# Altium schematic sheet PFC_15V_PwrSRegulator.SchDoc
size A4; SheetNumber: 4; SheetTotal: 8
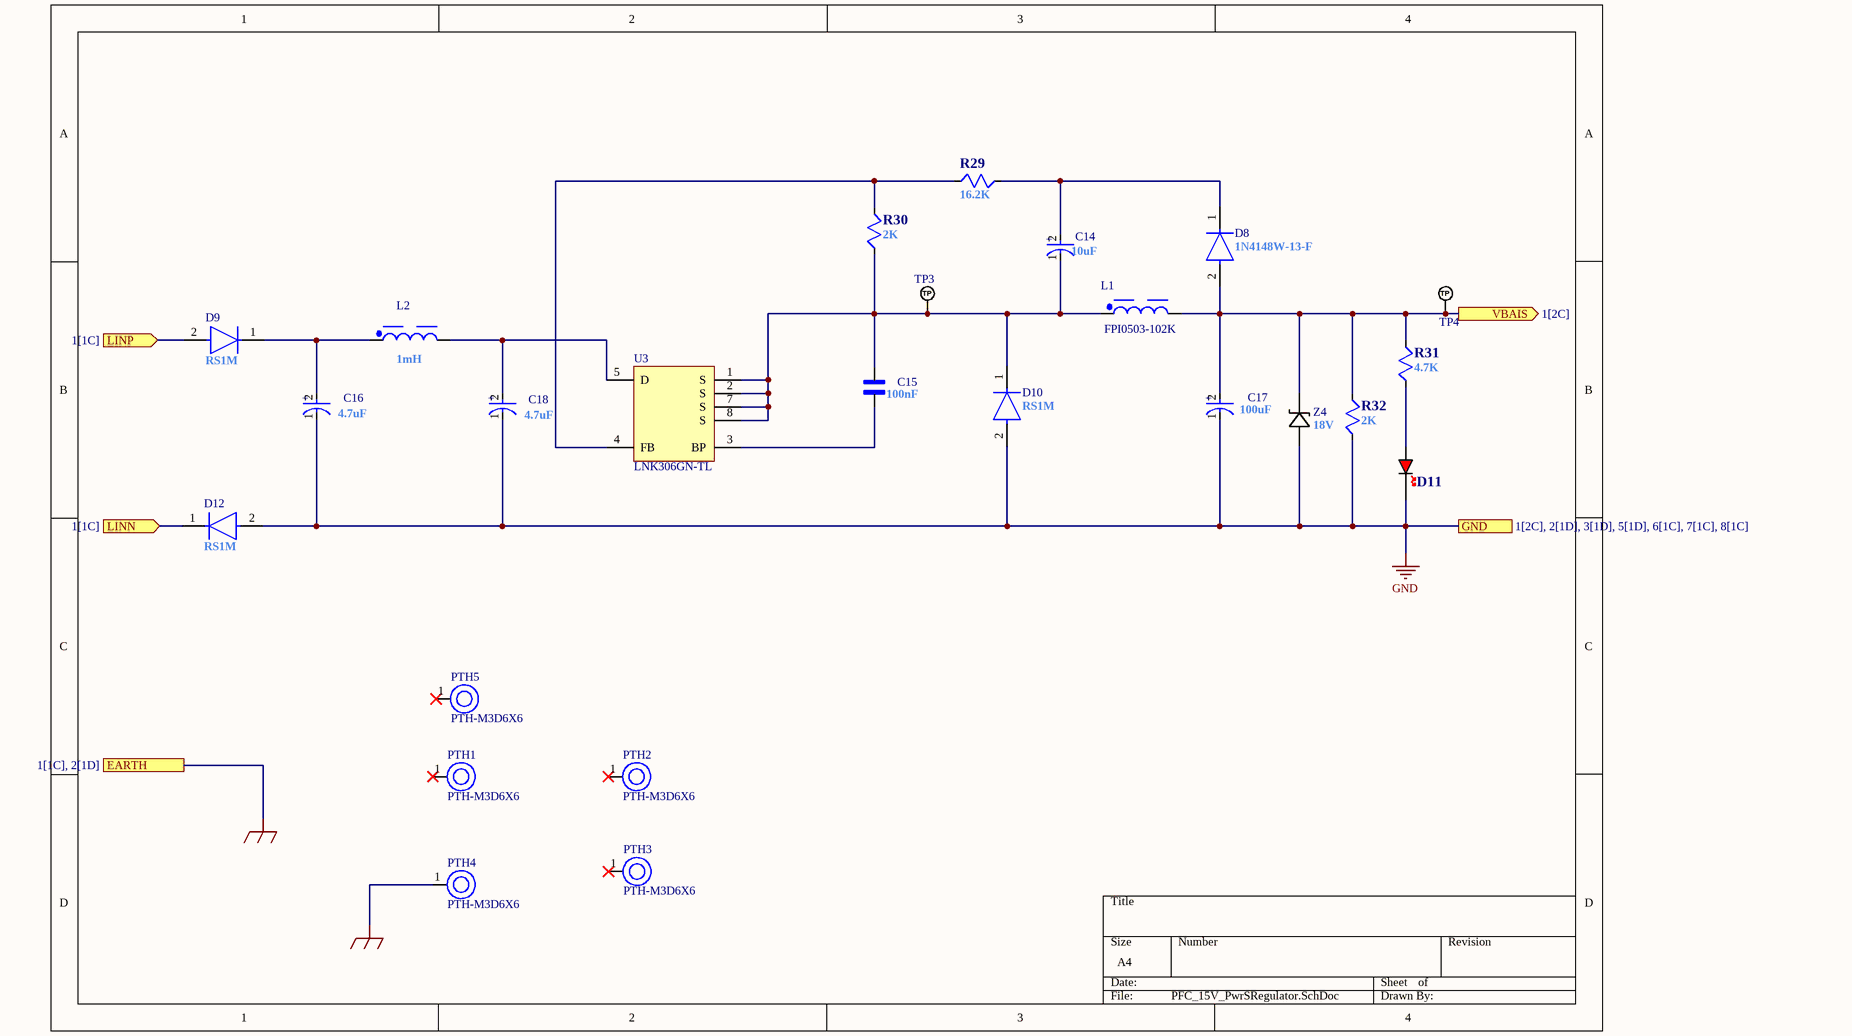
[diagram p0: PFC_15V_PwrSRegulator.SchDoc]

## Parts
C14  Capacitance: 10uF  [FP-FKC-MFG]  (hidden comment: SC1V106M05005VR)
C15  value 100nF  [CAPC3216X140N]  (hidden comment: C1206C104KARECAUTO)
C16  Capacitance: 4.7uF  [FP-RAD-TH-D_10_0_5-L_12_5-MFG]  (hidden comment: PKLH-400V4R7MG125-T/A5.0)
C17  Capacitance: 100uF  [FP-SEV8X10_5-MFG]  (hidden comment: CKL025M101F10PKKKV00A)
C18  Capacitance: 4.7uF  [FP-RAD-TH-D_10_0_5-L_12_5-MFG]  (hidden comment: PKLH-400V4R7MG125-T/A5.0)
D8  1N4148W-13-F  [FP-SOD123-MFG]
D9  RS1M  [FP-403AE-MFG]
D10  RS1M  [FP-403AE-MFG]
D11  19-21/R6C-AP1Q2/4T  [LED_0603_RED]  (value not drawn)
D12  RS1M  [FP-403AE-MFG]
L1  FPI0503-102K  [WE-LQS_6045]
L2  Inductance: 1mH  [WE-PD2_1054]  (hidden comment: FPI0705-102K(W0.15))
PTH1  PTH-M3D6X6  [PH3.2]
PTH2  PTH-M3D6X6  [PH3.2]
PTH3  PTH-M3D6X6  [PH3.2]
PTH4  PTH-M3D6X6  [PH3.2]
PTH5  PTH-M3D6X6  [PH3.2]
R29  value 16.2K  [RESC1608N]  (hidden comment: 0603SAF1622T5E)
R30  value 2K  [RESC1608N]  (hidden comment: HP03W5F2001T5E)
R31  value 4.7K  [RESC1608N]  (hidden comment: 0603SAF4701T5E)
R32  value 2K  [RESC1608N]  (hidden comment: HP03W5F2001T5E)
TP3  TP_NOBOM  [PAD_RND_1MM]  (value not drawn)  (no BOM)
TP4  TP_NOBOM  [PAD_RND_1MM]  (value not drawn)  (no BOM)
U3  LNK306GN-TL  [PI-SMD-8B-7_V]
Z4  Type: 18V  [ZDO_SOD323_DIO-M]  (hidden comment: MMSZ5248BS-7-F)

## Ports
EARTH (see 1[1C], 2[1D]), GND (see 1[2C], 2[1D], 3[1D], 5[1D], 6[1C], 7[1C], 8[1C]), LINN (in, see 1[1C]), LINP (in, see 1[1C]), VBAIS (out, see 1[2C])

## Nets
EARTH: PTH4.1 ; port EARTH
GND: C16.1(C) C17.1(C) C18.1(C) D10.2(A) D11.K D12.2(A) R32.2 Z4.2 ; port GND
LINN: D12.1(C) ; port LINN
LINP: D9.2(A) ; port LINP
VBAIS: C17.2(A) D8.2(A) L1.2 R31.1 R32.1 TP4.1(TP) Z4.1 ; port VBAIS
NetC14_1: C14.1(C) C15.2 D10.1(C) L1.1 R30.2 TP3.1(TP) U3.1(S) U3.2(S) U3.7(S) U3.8(S)
NetC14_2: C14.2(A) D8.1(C) R29.1
NetC15_1: C15.1 U3.3(BP)
NetC16_2: C16.2(A) D9.1(C) L2.1
NetC18_2: C18.2(A) L2.2 U3.5(D)
NetD11_A: D11.A R31.2
NetR29_2: R29.2 R30.1 U3.4(FB)

Not connected (* = marked no-connect by the designer): PTH1 1*; PTH2 1*; PTH3 1*; PTH5 1*

## Notes on the sheet
- (in symbol CMP-05427-000030-1) +
- (in symbol CMP-05427-001671-1) +
- (in symbol CMP-35376-000024-1) +

## Library data of the parts
C14 = CMP-05427-000030-1: CAP.EL.10uF 35V 5x5.3 85C SMD SAMWHA; Impedance: 1.52R; Ripple Current (AC): 32mA; Tolerance: 20%; Ripple Current: 85mA; Life (Hours): 2000Hour; Leakage Current: 3uA; Voltage Rating (DC): 50V; Dielectric Material: Aluminium; Length: 5.8mm; Voltage Rating: 35V; Radiation Hardening: No; Max Operating Temperature: 105°C; REACH SVHC: No SVHC; RoHS Compliant: Yes; Case/Package: Radial; Height: 5.8mm; Voltage: 35V; Diameter: 5mm; Number of Pins: 2; Series: FK; Lead Free: Lead Free; Width: 6.5mm; ESR (Equivalent Series Resistance): 1.52R; Package Quantity: 1000; Construction: Cylindrical; Packaging: Tape and Reel; Height - Seated (Max): 0.228inch; Contact Plating: Tin; Min Operating Temperature: -55°C; Termination: SMD/SMT; Material: Aluminium; Mount: Surface Mount
C15 = C1206C104KARECAUTO: 0.1 ÂµF Â±10% 250V Ceramic Capacitor X7R 1206 (3216 Metric); MF: KEMET; SnapEDA_Link: https://www.snapeda.com/parts/C1206C104KARECAUTO/Kemet/view-part/?ref=snap; Package: 3216 KEMET; MP: C1206C104KARECAUTO; Check_prices: https://www.snapeda.com/parts/C1206C104KARECAUTO/Kemet/view-part/?ref=eda
C16 C18 = CMP-05427-001671-1: CAP.EL.4u7 400V 10X12.5 5MM %20 105C LOW IMP; Dissipation Factor: 0.2%; Tolerance: 20%; Ripple Current (AC): 65mA; Polarity: Polar; Life (Hours): 2000Hour; Lead/Base Style: Straight; Lead Diameter: 0.6mm; Voltage Rating (DC): 350V; Length: 12.5mm; Height - Seated (Max): 0.531inch; Mount: Through Hole; Diameter: 10mm; Case/Package: Radial; Max Operating Temperature: 85°C; Ripple Current: 65mA; Radiation Hardening: No; Lead Pitch: 5mm; Packaging: Bulk; Termination: Radial; Construction: RADIAL; Series: M; REACH SVHC: No SVHC; RoHS Compliant: Yes; Voltage Rating: 350V; Min Operating Temperature: -25°C; Height: 12.5mm; Package Quantity: 200
C17 = CMP-35376-000024-1: CAP.EL.100uF 25V 8x10 105C 5000H AEC-Q200 SMT; Polarity: Polar; Life (Hours): 2000Hour; Tolerance: 20%; Ripple Current: 240mA; Case/Package: Radial; Package Quantity: 1; Voltage Rating: 25V; Min Operating Temperature: -40°C; Lead Pitch: 3.1mm; Height - Seated (Max): 0.413inch; Ratings: AEC-Q200; Lead Free: Lead Free; Construction: Cylindrical; Max Operating Temperature: 85°C; Packaging: Tape and Reel; RoHS Compliant: Yes; Mount: Surface Mount; Radiation Hardening: No; Series: SEV
D8 = CMP-12791-000005-1: DIODE GEN PURP 100V 150MA SOD123; Manufacturer: Diodes Inc.; Capacitance: 2pF; Forward Current: 300mA; Max Junction Temp: +150°C; Value: 2pF; Standoff Height: 0mm; Peak Reverse Current: 1uA; Max Surge Forward Current: 1A; Category: Diode; Height: 1.45mm; ComponentLink2URL: https://upverter.com/datasheet/628e7d6fee5901eee6eef4567d1c3569f2cd3cde.pdf; Lead Free: Yes; ComponentLink2Description: Datasheet; Octopart: https://octopart.com/1n4148w-13-f-diodes+inc.-2359612; Temperature Range High: +150°C; Device Class L2: Diodes; Digikey Description: DIODE GEN PURP 100V 150MA SOD123; Reverse Voltage: 100V; Temperature Range Low: -65°C; Device Class L1: Discrete Semiconductors; Package: SOD123; RoHS: TRUE; Manufacturer Part Number: 1N4148W-13-F; Footprint Url: https://www.diodes.com/assets/Package-Files/SOD123.pdf; Automotive: No; Max Repetitive Reverse Voltage: 100V; Mouser Description: 1N4148W Series 2 A 100 V 400 mW Surface Mount Fast Switching Diode - SOD-123; Temperature: -65°C to +150°C; Device Class L3: Rectifier Diodes
D9 D10 D12 = CMP-07163-000022-1: DIODE GEN PURP 1KV 1A SMA; Manufacturer: ON Semiconductor; Max Surge Forward Current: 30A; Max Repetitive Reverse Voltage: 1000V; Value: 10pF; Max Junction Temp: +150°C; Peak Reverse Current: 5uA; Standoff Height: 0.05mm; ComponentLink2URL: https://www.onsemi.com/pub/Collateral/RS1M-D.PDF; Footprint Url: https://www.onsemi.com/pub/Collateral/403AE.PDF; Mouser Description: On a Reel of 7500, ON Semi 1000V 1A, Diode, 2-Pin DO-214AC RS1M; Package: 403AE; Manufacturer Part Number: RS1M; Temperature Range Low: -55°C; Device Class L1: Discrete Semiconductors; Automotive: No; Height: 2.5mm; Octopart: https://octopart.com/rs1m-on+semiconductor-84331238; Digikey Description: DIODE GEN PURP 1KV 1A SMA; Temperature Range High: +150°C; Capacitance: 10pF; RoHS: TRUE; Device Class L2: Diodes; ComponentLink2Description: Datasheet; Temperature: -55°C to +150°C; Device Class L3: Rectifier Diodes; Forward Current: 1A; Lead Free: Yes; Category: Diode
D11 = LED_0603_RED: LED SMD 0603 RED 28.5-72mcd 100° WATER CLEAR
L1 = CMP-03913-61645236-2: POWER INDUCTOR General Purpose Inductor, 1000uH, 10%, 1 Element, SMD, 2424; Inductance Tolerance: 20%; Test Frequency: 100kHz; Saturation Current: 365mA; Inductance: 1mH; Self Resonant Frequency: 1.86MHz; Current Rating: 300mA; DC Resistance (DCR): 4.783Ω; Shielding: Shielded; Length: 6mm; Min Operating Temperature: -40°C; Height: 4.5mm; Ambient Temperature Range Low: -40°C; Composition: Wirewound; RoHS: Compliant; Ambient Temperature Range High: 85°C; Height - Seated (Max): 4.4958mm; Mount: Surface Mount; Max Operating Temperature: 125°C; Packaging: Tape & Reel (TR); Case/Package: Nonstandard; Tolerance: 20%; Width: 6mm
L2 = CMP-0227-00499-2: INDUCTOR POWER 1mH 7.8X7.0X5.0MM SMD; Test Frequency: 10kHz; DC Resistance (DCR): 3.3 Ohm; RMS Current (Irms): 380mA; Tolerance: 10%; Inductance Tolerance: 20%; Shielding: Unshielded; Core Material: Ferrite; Packaging: Digi-Reel®; Composition: Wirewound; Lead Free: Lead Free; Min Operating Temperature: -40°C; Saturation Current: N/A; RoHS: Compliant; Height - Seated (Max): 5.8928mm; Ambient Temperature Range Low: -40°C; Case/Package: Nonstandard; Termination: SMD/SMT; REACH SVHC: Unknown; Width: 10mm; Ambient Temperature Range High: 85°C; Length: 9mm; Mount: Surface Mount; Height: 5.4mm; Max Operating Temperature: 125°C
PTH1-PTH5 = PTH_S1
R29 = RES: RES.(1608) 0603 16.2K Ohms 1% 1/10W-S 100PPM
R30 R32 = RES: RES.(1608) 0603 2K Ohms 1% 1/5W
R31 = RES: RES.(1608) 0603 4.7K Ohms 1% 1/10W-S 100PPM
TP3 TP4 = TEST_POINT_RND_1MM: Test Point Round 1mm (NO BOM)
U3 = CMP-2000-06569-1: Lowest Component Count, Energy-Efficient Off-Line Switcher IC, 85 to 265 V, 220 uA, -40 to 150 degC, 7-Pin SMD, RoHS, Tube; Manufacturer: Power Integrations; Output type: Adjustable; Function: Regulator; Topology: Flyback; Input voltage: 85...265VAC; Mounting Technology: SurfaceMount; Datasheet Version: Rev. J, 06/2013; Datasheet URL: http://www.mouser.com/ds/2/328/lnk302_304-306-179954.pdf; Package Reference: SMD-8B-7; Manufacturer URL: https://www.power.com/; Package: SMD-8B(7-PIN); Package Description: 7-Pin Surface Mount Device, Body 9.575 x 6.35 mm
Z4 = MMSZ5248BS-7-F: Zener Diode 18 V 200 mW ±5% Surface Mount SOD-323; Manufacturer_Name: Diodes Inc; Copyright: Copyright (C) 2026 Ultra Librarian. All rights reserved.; Manufacturer_Part_Number: MMSZ5248BS-7-F